# Altium schematic sheet GL852-3.SchDoc
size A4
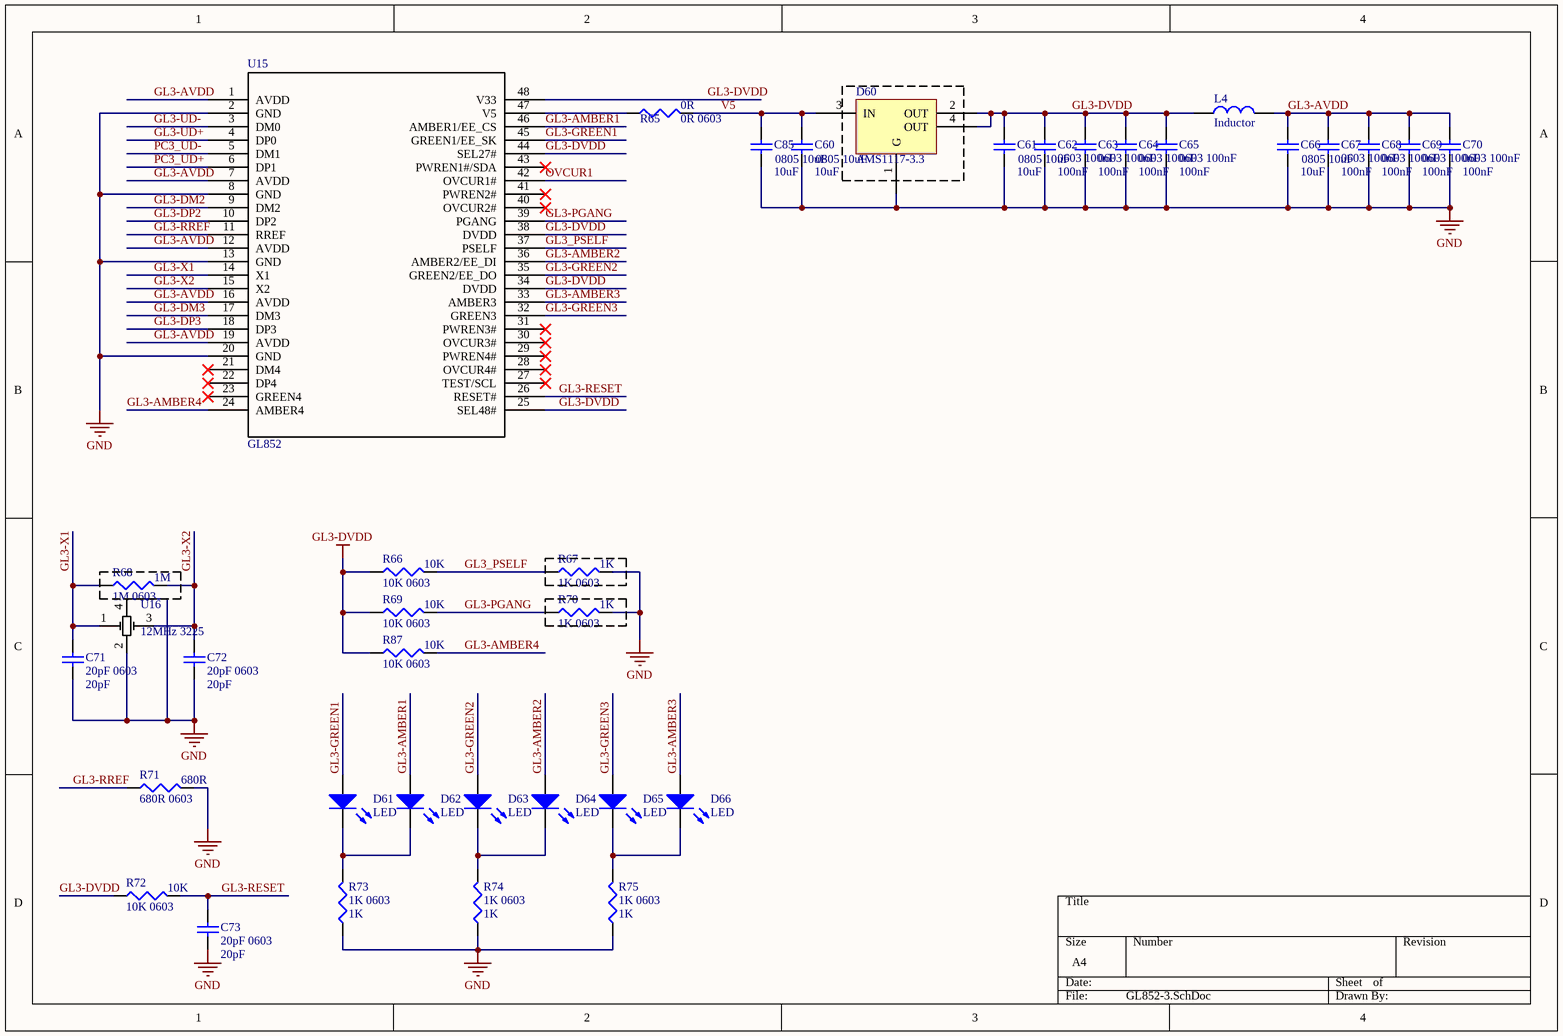
[diagram p0: GL852-3.SchDoc]

## Parts
C60  0805 10uF  value 10uF  [C0805]
C61  0805 10uF  value 10uF  [C0805]
C62  0603 100nF  value 100nF  [C0603]
C63  0603 100nF  value 100nF  [C0603]
C64  0603 100nF  value 100nF  [C0603]
C65  0603 100nF  value 100nF  [C0603]
C66  0805 10uF  value 10uF  [C0805]
C67  0603 100nF  value 100nF  [C0603]
C68  0603 100nF  value 100nF  [C0603]
C69  0603 100nF  value 100nF  [C0603]
C70  0603 100nF  value 100nF  [C0603]
C71  20pF 0603  value 20pF  [C0603]
C72  20pF 0603  value 20pF  [C0603]
C73  20pF 0603  value 20pF  [C0603]
C85  0805 10uF  value 10uF  [C0805]
D60  AMS1117-3.3  [SOT-223]
D61  LED  [LED0603]
D62  LED  [LED0603]
D63  LED  [LED0603]
D64  LED  [LED0603]
D65  LED  [LED0603]
D66  LED  [LED0603]
L4  Inductor  [L0603]
R65  0R 0603  value 0R  [R0603]
R66  10K 0603  value 10K  [R0603]
R67  1K 0603  value 1K  [R0603]
R68  1M 0603  value 1M  [R0603]
R69  10K 0603  value 10K  [R0603]
R70  1K 0603  value 1K  [R0603]
R71  680R 0603  value 680R  [R0603]
R72  10K 0603  value 10K  [R0603]
R73  1K 0603  value 1K  [R0603]
R74  1K 0603  value 1K  [R0603]
R75  1K 0603  value 1K  [R0603]
R87  10K 0603  value 10K  [R0603]
U15  GL852  [qfp48-20-0909b]
U16  12MHz 3225  [XTAL-3225]

## Nets
GL3-DVDD: C61.2 C62.2 C63.2 C64.2 C65.2 D60.2(OUT) D60.4(OUT) L4.1 R66.1 R69.1 R72.1 R87.1 U15.25(SEL48#) U15.34(DVDD) U15.38(DVDD) U15.44(SEL27#) U15.48(V33)
GND: C60.1 C61.1 C62.1 C63.1 C64.1 C65.1 C66.1 C67.1 C68.1 C69.1 C70.1 C71.1 C72.1 C73.1 C85.1 D60.1(G) R67.2 R70.2 R71.2 R73.1 R74.1 R75.1 U15.2(GND) U15.8(GND) U15.13(GND) U15.20(GND) U16.2 U16.4
GL3-AMBER1: D62.1(A) U15.46(AMBER1/EE_CS)
GL3-AMBER2: D64.1(A) U15.36(AMBER2/EE_DI)
GL3-AMBER3: D66.1(A) U15.33(AMBER3)
GL3-AMBER4: R87.2 U15.24(AMBER4)
GL3-AVDD: C66.2 C67.2 C68.2 C69.2 C70.2 L4.2 U15.1(AVDD) U15.7(AVDD) U15.12(AVDD) U15.16(AVDD) U15.19(AVDD)
GL3-DM2: U15.9(DM2)
GL3-DM3: U15.17(DM3)
GL3-DP2: U15.10(DP2)
GL3-DP3: U15.18(DP3)
GL3-GREEN1: D61.1(A) U15.45(GREEN1/EE_SK)
GL3-GREEN2: D63.1(A) U15.35(GREEN2/EE_DO)
GL3-GREEN3: D65.1(A) U15.32(GREEN3)
GL3-PGANG: R69.2 R70.1 U15.39(PGANG)
GL3-RESET: C73.2 R72.2 U15.26(RESET#)
GL3-RREF: R71.1 U15.11(RREF)
GL3-UD+: U15.4(DP0)
GL3-UD-: U15.3(DM0)
GL3-X1: C71.2 R68.1 U15.14(X1) U16.1
GL3-X2: C72.2 R68.2 U15.15(X2) U16.3
GL3_PSELF: R66.2 R67.1 U15.37(PSELF)
OVCUR1: U15.42(OVCUR1#)
PC3_UD+: U15.6(DP1)
PC3_UD-: U15.5(DM1)
V5: C60.2 C85.2 D60.3(IN) R65.2
NetD61_2: D61.2(K) D62.2(K) R73.2
NetD63_2: D63.2(K) D64.2(K) R74.2
NetD65_2: D65.2(K) D66.2(K) R75.2
NetR65_1: R65.1 U15.47(V5)

Not connected (* = marked no-connect by the designer): U15 21(DM4)* 22(DP4)* 23(GREEN4)* 27(TEST/SCL)* 28(OVCUR4#)* 29(PWREN4#)* 30(OVCUR3#)* 31(PWREN3#)* 40(OVCUR2#)* 41(PWREN2#)* 43(PWREN1#/SDA)*

## Library data of the parts
C60-C73 C85 = Cap Semi: Capacitor (Semiconductor SIM Model); Published: 8-Jun-2000; LatestRevisionDate: 29-May-2009; LatestRevisionNote: IPC-7351 Footprint Added.; PackageReference: C1206; Publisher: Altium Limited; PackageDescription: Chip Capacitor
R65-R75 R87 = Res3: Resistor; Published: 8-Jun-2000; LatestRevisionDate: 29-May-2009; LatestRevisionNote: IPC-7351 Footprint Added.; PackageReference: J1-0603; Publisher: Altium Limited; PackageDescription: Chip Resistor
U15 = GL852: Imported; Devide: GL852; RefDes: RefDes; Type: DEV; Value: Value
U16 = Component_1